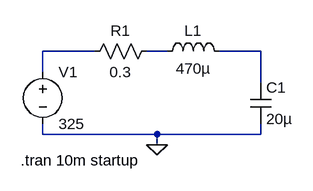
[diagram p0: schematic lcr_filter.asc]
lcr_filter.asc, the LTspice schematic file:
Version 4
SHEET 1 880 680
WIRE -16 128 -96 128
WIRE 96 128 64 128
WIRE 240 128 176 128
WIRE -96 160 -96 128
WIRE 240 176 240 128
WIRE -96 256 -96 240
WIRE 80 256 -96 256
WIRE 240 256 240 240
WIRE 240 256 80 256
WIRE 80 272 80 256
FLAG 80 272 0
SYMBOL ind 80 144 R270
WINDOW 0 32 56 VTop 2
WINDOW 3 5 56 VBottom 2
SYMATTR InstName L1
SYMATTR Value 470µ
SYMBOL cap 224 176 R0
SYMATTR InstName C1
SYMATTR Value 20µ
SYMBOL res 80 112 R90
WINDOW 0 0 56 VBottom 2
WINDOW 3 32 56 VTop 2
SYMATTR InstName R1
SYMATTR Value 0.3
SYMBOL voltage -96 144 R0
WINDOW 123 0 0 Left 0
WINDOW 39 0 0 Left 0
SYMATTR InstName V1
SYMATTR Value 325
TEXT -130 296 Left 2 !.tran 10m startup

The netlist it stands for:
* lcr_filter.asc
L1 N002 N003 470µ
C1 N003 0 20µ
R1 N002 N001 0.3
V1 N001 0 325
.tran 10m startup
.backanno
.end